# EAGLE design etchasketch (EAGLE 9.6.2)
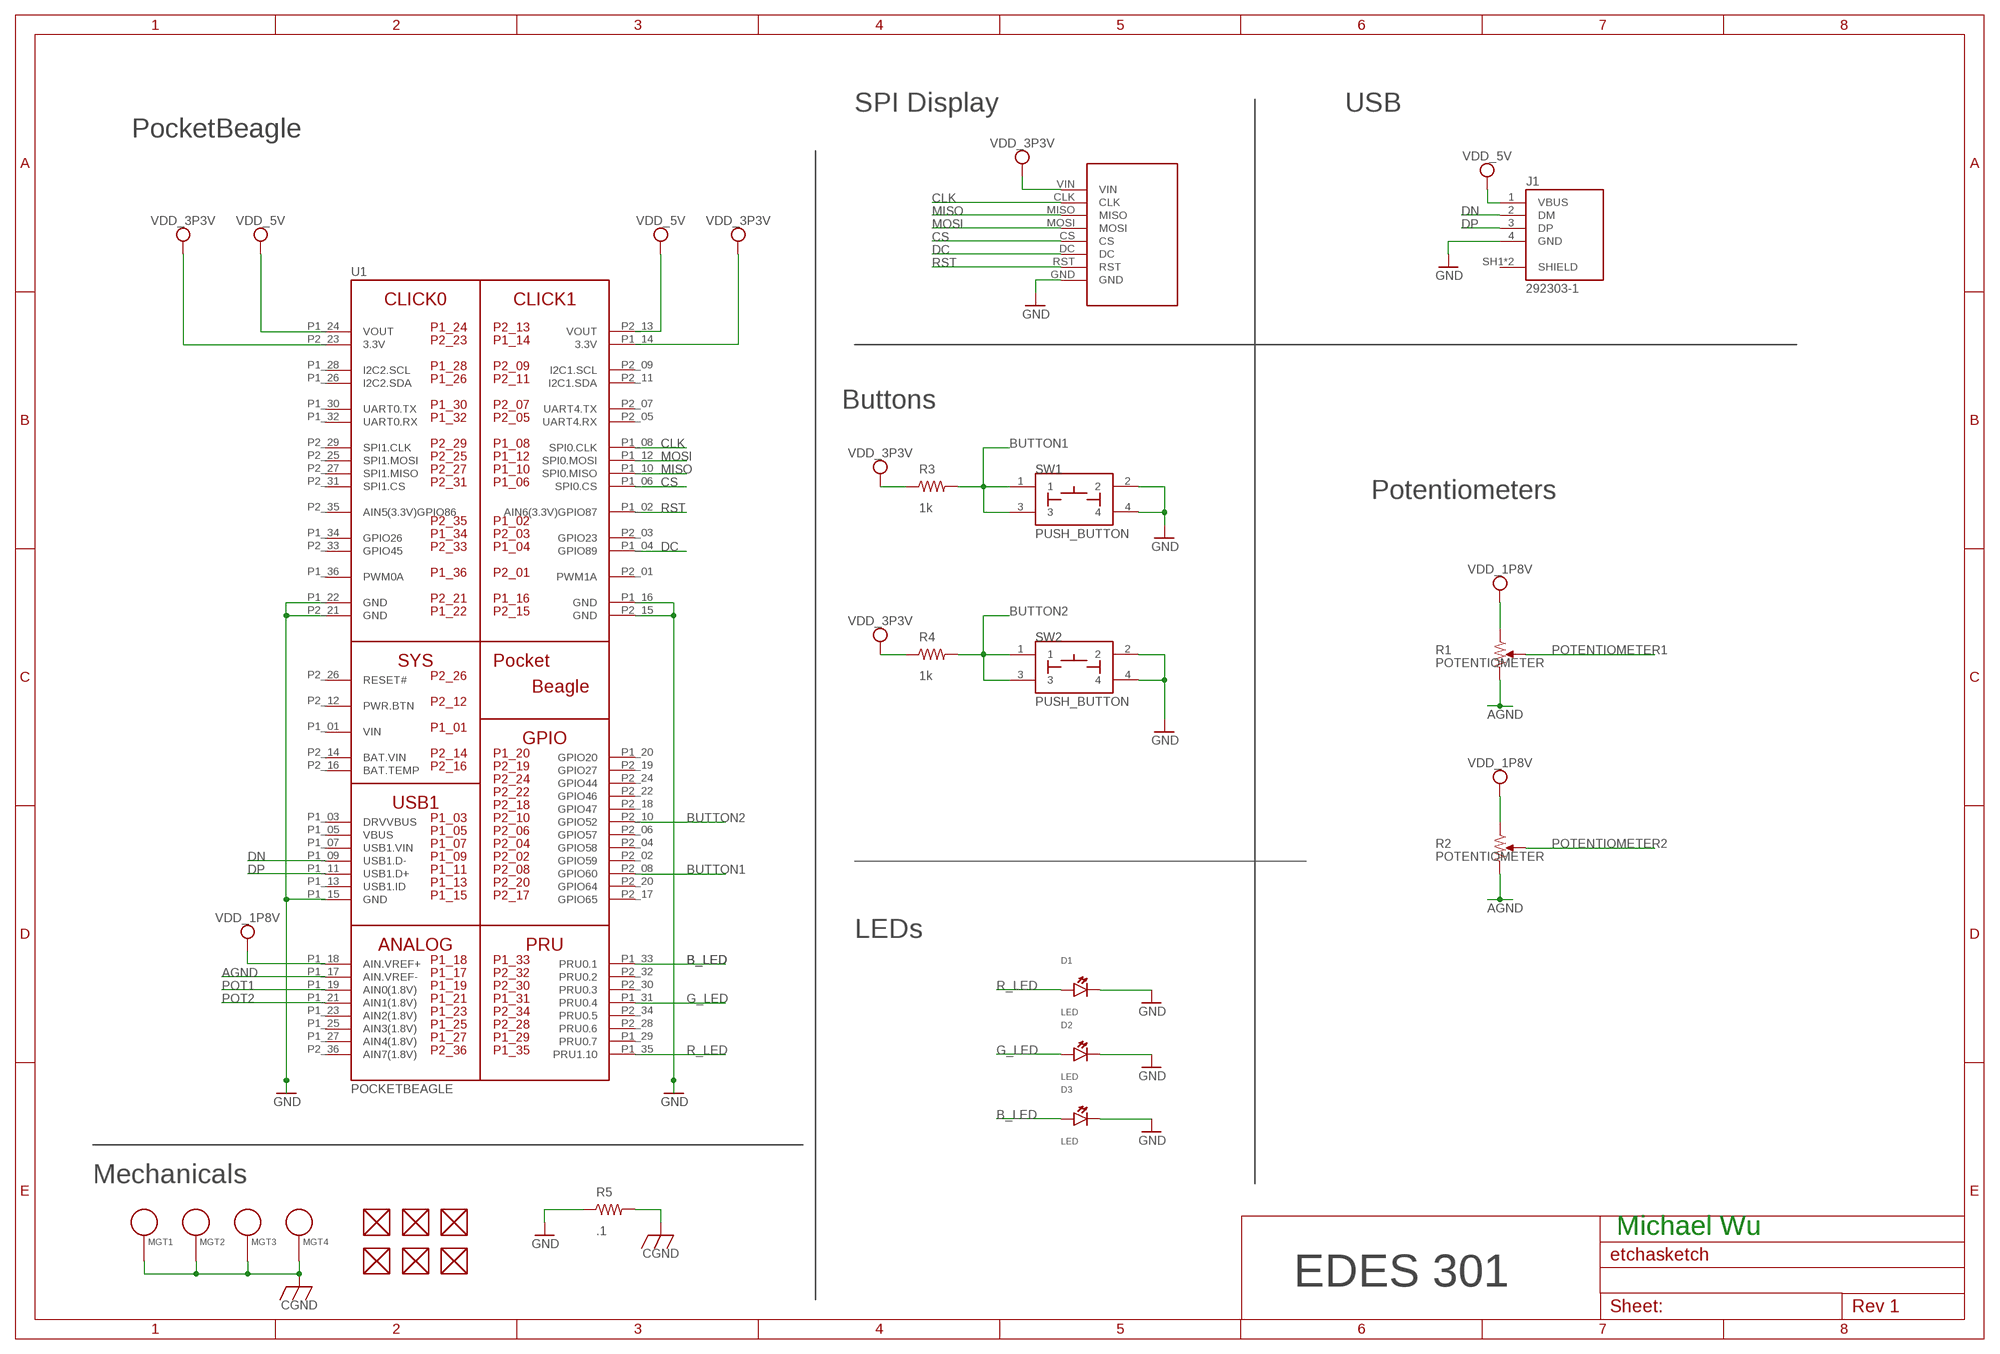
[diagram p0: schematic, sheet 1]

## Parts
D1  LED  [EIA-STD]
D2  LED  [EIA-STD]
D3  LED  [EIA-STD]
FUD1  FIDUCIAL  [FIDUCIAL_40MIL]
FUD2  FIDUCIAL  [FIDUCIAL_40MIL]
FUD3  FIDUCIAL  [FIDUCIAL_40MIL]
FUD4  FIDUCIAL  [FIDUCIAL_40MIL]
FUD5  FIDUCIAL  [FIDUCIAL_40MIL]
FUD6  FIDUCIAL  [FIDUCIAL_40MIL]
J1  292303-1  [TE_292303-1]
MGT1  MOUNTING_HOLE  [MOUNTING_HOLE]
MGT2  MOUNTING_HOLE  [MOUNTING_HOLE]
MGT3  MOUNTING_HOLE  [MOUNTING_HOLE]
MGT4  MOUNTING_HOLE  [MOUNTING_HOLE]
R1  POTENTIOMETER  [POT-PO90S]
R2  POTENTIOMETER  [POT-PO90S]
R3  1k  R_R0603  [R0603]
R4  1k  R_R0603  [R0603]
R5  .1  R_R1206  [R1206]
SW1  PUSH_BUTTON  [BUTTON_12.5MM]
SW2  PUSH_BUTTON  [BUTTON_12.5MM]
U1  POCKETBEAGLE  [POCKETBEAGLE]
U$1  SCREEN  [SCREEN]

## Nets
AGND: R1.CW R2.CW U1.P1_17(AIN.VREF-)
B_LED: D3.ANODE U1.P1_33(PRU0.1)
BUTTON1: R3.2 SW1.1 SW1.3 U1.P2_08(GPIO60)
BUTTON2: R4.2 SW2.1 SW2.3 U1.P2_10(GPIO52)
CGND: MGT1.P$1 MGT2.P$1 MGT3.P$1 MGT4.P$1 R5.2
CLK: U1.P1_08(SPI0.CLK) U$1.CLK
CS: U1.P1_06(SPI0.CS) U$1.CS
DC: U1.P1_04(GPIO89) U$1.DC
DN: J1.2(DM) U1.P1_09(USB1.D-)
DP: J1.3(DP) U1.P1_11(USB1.D+)
G_LED: D2.ANODE U1.P1_31(PRU0.4)
GND [pwr/gnd]: D1.CATHODE D2.CATHODE D3.CATHODE J1.4(GND) R5.1 SW1.2 SW1.4 SW2.2 SW2.4 U1.P1_15(GND) U1.P1_16(GND) U1.P1_22(GND) U1.P2_15(GND) U1.P2_21(GND) U$1.GND
MISO: U1.P1_10(SPI0.MISO) U$1.MISO
MOSI: U1.P1_12(SPI0.MOSI) U$1.MOSI
POT1: U1.P1_19(AIN0(1.8V))
POT2: U1.P1_21(AIN1(1.8V))
POTENTIOMETER1: R1.S
POTENTIOMETER2: R2.S
R_LED: D1.ANODE U1.P1_35(PRU1.10)
RST: U1.P1_02(AIN6(3.3V)GPIO87) U$1.RST
VDD_1P8V: R1.CCW R2.CCW U1.P1_18(AIN.VREF+)
VDD_3P3V: R3.1 R4.1 U1.P1_14(3.3V) U1.P2_23(3.3V) U$1.VIN
VDD_5V: J1.1(VBUS) U1.P1_24(VOUT) U1.P2_13(VOUT)
Unconnected: FUD1.P$1 FUD2.P$1 FUD3.P$1 FUD4.P$1 FUD5.P$1 FUD6.P$1 J1.SH1(SHIELD) J1.SH2(SHIELD) U1.P1_03(DRVVBUS) U1.P1_05(VBUS) U1.P1_07(USB1.VIN) U1.P1_13(USB1.ID) U1.P1_20(GPIO20) U1.P1_23(AIN2(1.8V)) U1.P1_25(AIN3(1.8V)) U1.P1_26(I2C2.SDA) U1.P1_27(AIN4(1.8V)) U1.P1_28(I2C2.SCL) U1.P1_29(PRU0.7) U1.P1_30(UART0.TX) U1.P1_32(UART0.RX) U1.P1_34(GPIO26) U1.P1_36(PWM0A) U1.P2_01(PWM1A) U1.P2_02(GPIO59) U1.P2_03(GPIO23) U1.P2_04(GPIO58) U1.P2_05(UART4.RX) U1.P2_06(GPIO57) U1.P2_07(UART4.TX) U1.P2_09(I2C1.SCL) U1.P2_11(I2C1.SDA) U1.P2_12(PWR.BTN) U1.P2_16(BAT.TEMP) U1.P2_17(GPIO65) U1.P2_18(GPIO47) U1.P2_19(GPIO27) U1.P2_20(GPIO64) U1.P2_22(GPIO46) U1.P2_24(GPIO44) U1.P2_25(SPI1.MOSI) U1.P2_26(RESET#) U1.P2_27(SPI1.MISO) U1.P2_28(PRU0.6) U1.P2_29(SPI1.CLK) U1.P2_30(PRU0.3) U1.P2_31(SPI1.CS) U1.P2_32(PRU0.2) U1.P2_33(GPIO45) U1.P2_34(PRU0.5) U1.P2_35(AIN5(3.3V)GPIO86) U1.P2_36(AIN7(1.8V))

## Notes on the sheet
- SPI Display | USB
- PocketBeagle
- Buttons
- Potentiometers
- LEDs
- Mechanicals
- Michael Wu
- EDES 301

## Power pins joined to a net without a drawn wire
BAT.VIN: U1.P2_14(BAT.VIN)
VIN: U1.P1_01(VIN)

## Library data of the parts
D1-D3 = etchasketch:LED: EIA-STD LED, LTST-C191TBKT
FUD1-FUD6 = etchasketch:FIDUCIAL
J1 = etchasketch:292303-1: CONN USB RECEPT R/A TYPE A 4POS Check availability <https://pricing.snapeda.com/parts/292303-1/TE%20Connectivity/view-part?ref=eda>; AVAILABILITY: In Stock; CENTERLINE_PITCH: 2 mm[.078 in]; COMMENT: 292303-1; DESCRIPTION: Conn; Data; USB; Recept; 2.0; 4 Pos; 1 Port; Rt Angle; A Ser; Tin over Copper; EU_ROHS_COMPLIANCE: Compliant; MF: TE Connectivity; MP: 292303-1; NUMBER_OF_POSITIONS: 4; PACKAGE: None; PRICE: None; PRODUCT_TYPE: Connector; PURCHASE-URL: https://pricing.snapeda.com/search/part/292303-1/?ref=eda
MGT1-MGT4 = etchasketch:MOUNTING_HOLE: Chassis Mounting Hole w/GND connection ability
R1 R2 = etchasketch:POTENTIOMETER: Potentiometer - Examples: P090S-14T20BR10K (987-1277-ND)
R3 R4 = MISC:R_: RESISTOR, American symbol
R5 = etchasketch:R_: RESISTOR, American symbol
SW1 SW2 = etchasketch:PUSH_BUTTON
U1 = etchasketch:POCKETBEAGLE
U$1 = etchasketch:SCREEN

## Net classes
1 pwr/gnd: width 0.381 mm, drill 0.305 mm, clearance 0.381 mm

## Board
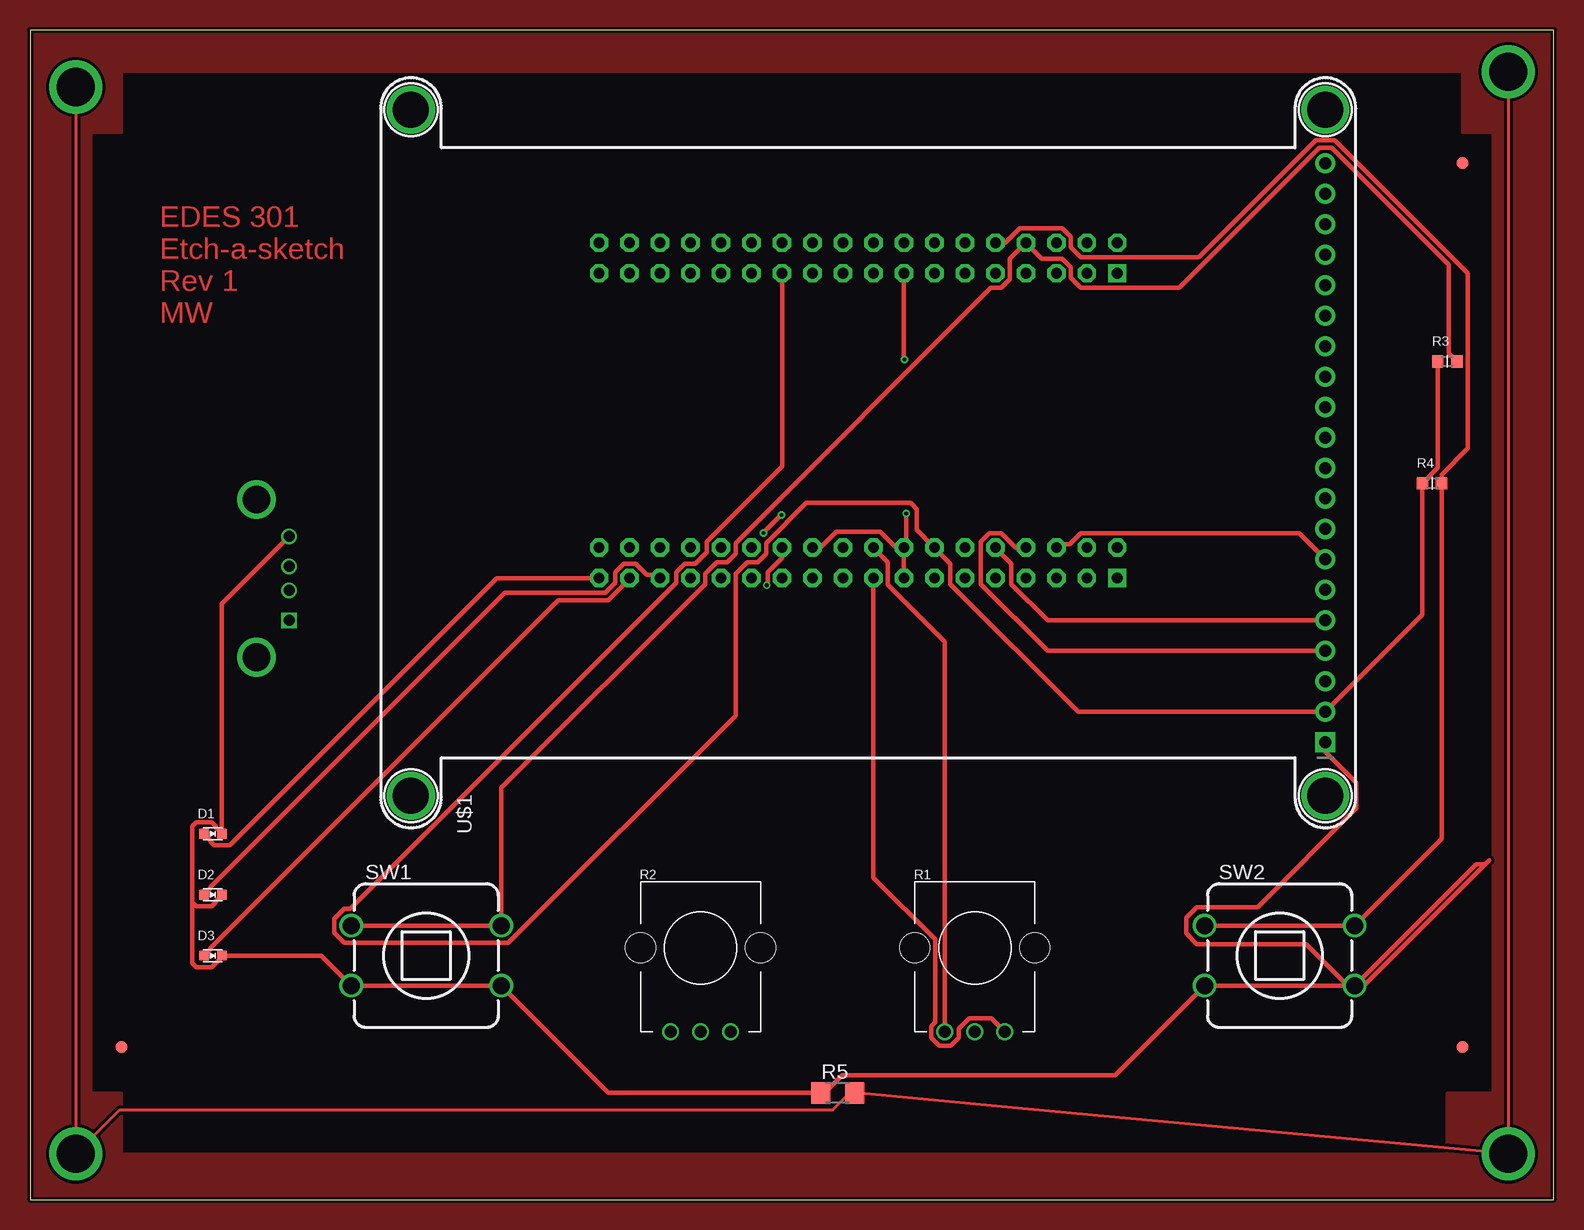
[diagram p1: board, top side]
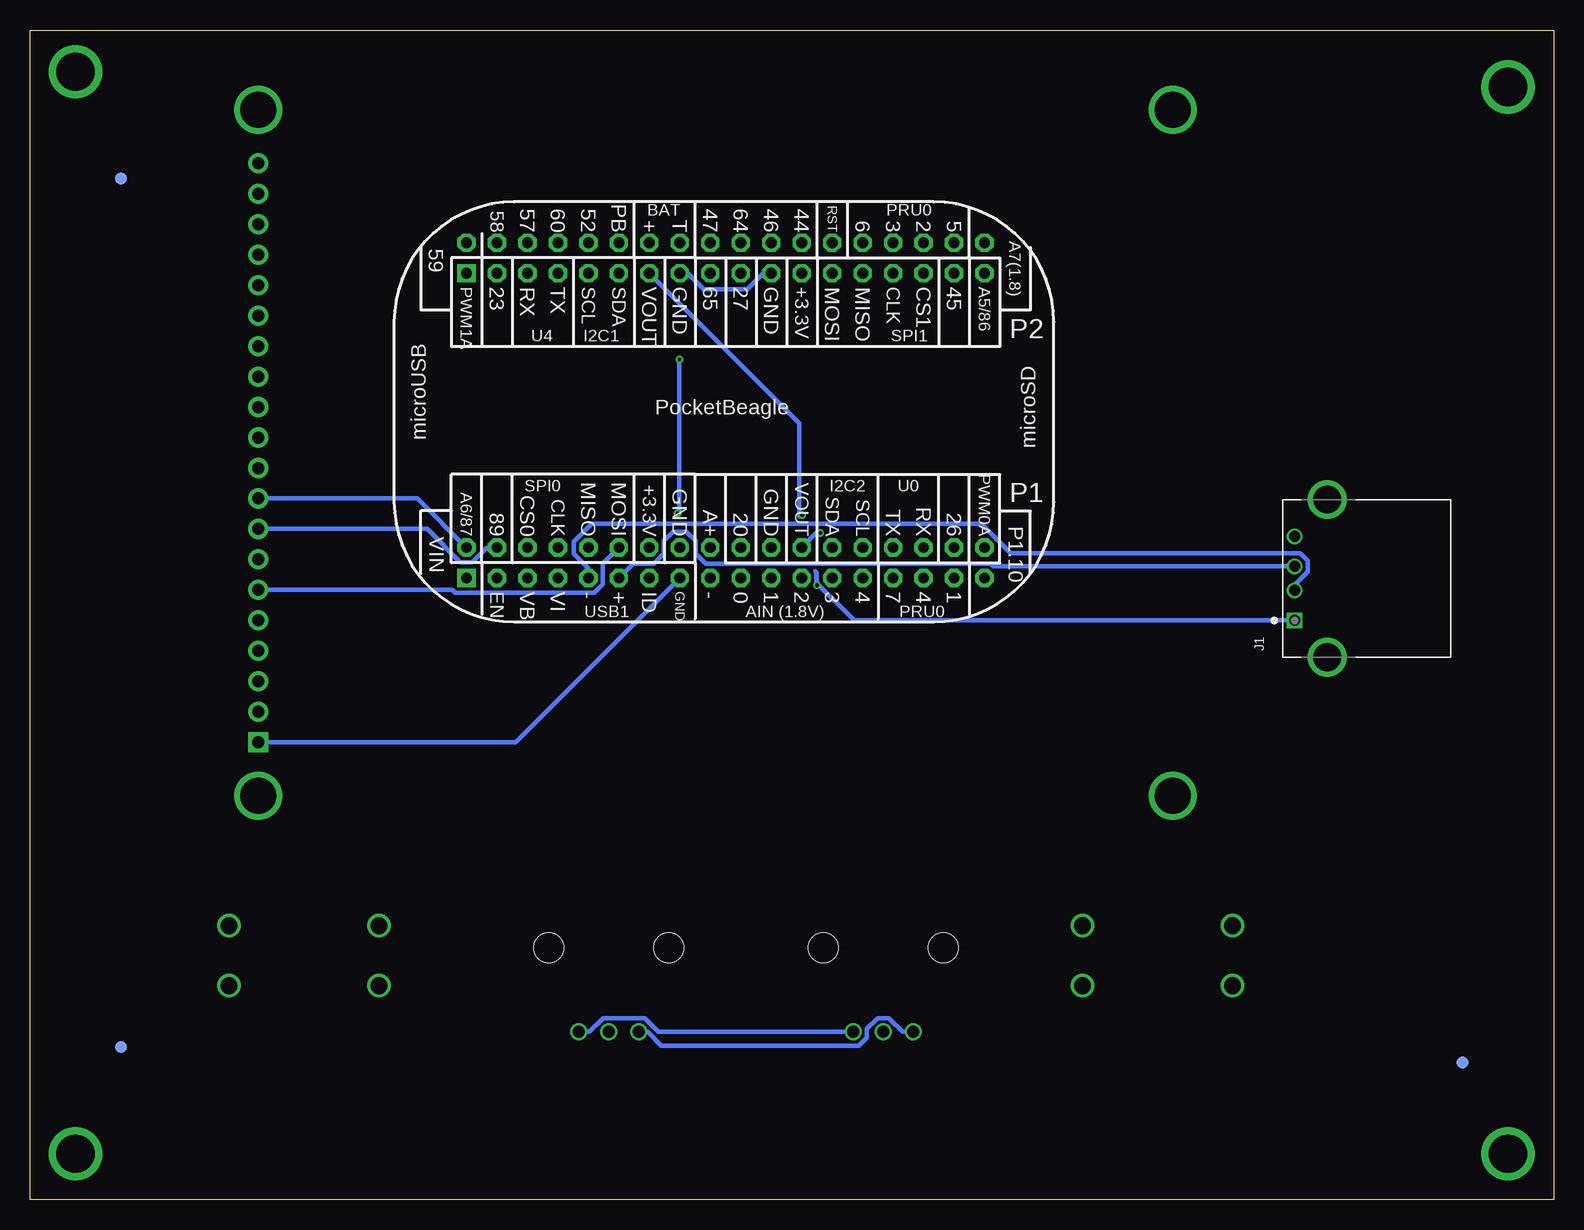
[diagram p2: board, bottom side, seen from below]

Size 126.98 x 97.46 mm. Coordinates in mm from the lower left corner, seen from the top.
Outline: 0,0 126.98,0 126.98,97.46 0,97.46 0,0
Copper layers (1*16): Top 0.035mm / dielectric 1.53mm / Bottom 0.035mm
Design rules "EDES301_2lyr": minimum track width 10mil, minimum drill 12mil, track to track 10mil, track to pad 10mil, pad to pad 10mil, via to via 10mil, smd to smd 10mil, copper to edge 10mil, drill to drill 12mil, minimum pad ring 6mil, minimum via ring 6mil, stop-mask expansion 3mil, vias tented up to drill 25mil, thermal gap 10mil

### Footprints (pad centres in the part's own frame; a part is rotated, then mirrored left to right if it is on the bottom)
EIA-STD = smd 0.8 x 0.8: ANODE -0.75,0; CATHODE 0.75,0
FIDUCIAL_40MIL = smd 1.016 x 1.016: P$1 0,0
TE_292303-1 = drill 0.92 square: 1 0,0 | drill 0.92: 2 2.5,0; 3 4.5,0; 4 7,0 | drill 2.3: SH1 -3.07,-2.71; SH2 10.07,-2.71
MOUNTING_HOLE = drill 3.175 pad 4.445: P$1 0,0
POT-PO90S = drill 1: CCW -2.5,0; CW 2.5,0; S 0,0 | hole 2.5: -5,7; 5,7
R0603 = smd 0.95 x 1.031: 1 -0.8,0; 2 0.8,0
R1206 = smd 1.6 x 1.803: 1 -1.422,0; 2 1.422,0
BUTTON_12.5MM = drill 1.4: 1 -6.25,2.5; 2 -6.25,-2.5; 3 6.25,2.5; 4 6.25,-2.5
POCKETBEAGLE = drill 0.889 pad 1.524 square: P1_01 5.91,3.53; P2_01 5.91,28.93 | drill 0.889 pad 1.524 octagon: P1_02 5.91,6.07; P1_03 8.45,3.53; P1_04 8.45,6.07; P1_05 10.99,3.53; P1_06 10.99,6.07; P1_07 13.53,3.53; P1_08 13.53,6.07; P1_09 16.07,3.53; P1_10 16.07,6.07; P1_11 18.61,3.53; P1_12 18.61,6.07; P1_13 21.15,3.53; P1_14 21.15,6.07; P1_15 23.69,3.53; P1_16 23.69,6.07; P1_17 26.23,3.53; P1_18 26.23,6.07; P1_19 28.77,3.53; P1_20 28.77,6.07; P1_21 31.31,3.53; P1_22 31.31,6.07; P1_23 33.85,3.53; P1_24 33.85,6.07; P1_25 36.39,3.53; P1_26 36.39,6.07; P1_27 38.93,3.53; P1_28 38.93,6.07; P1_29 41.47,3.53; P1_30 41.47,6.07; P1_31 44.01,3.53; P1_32 44.01,6.07; P1_33 46.55,3.53; P1_34 46.55,6.07; P1_35 49.09,3.53; P1_36 49.09,6.07; P2_02 5.91,31.47; P2_03 8.45,28.93; P2_04 8.45,31.47; P2_05 10.99,28.93; P2_06 10.99,31.47; P2_07 13.53,28.93; P2_08 13.53,31.47; P2_09 16.07,28.93; P2_10 16.07,31.47; P2_11 18.61,28.93; P2_12 18.61,31.47; P2_13 21.15,28.93; P2_14 21.15,31.47; P2_15 23.69,28.93; P2_16 23.69,31.47; P2_17 26.23,28.93; P2_18 26.23,31.47; P2_19 28.77,28.93; P2_20 28.77,31.47; P2_21 31.31,28.93; P2_22 31.31,31.47; P2_23 33.85,28.93; P2_24 33.85,31.47; P2_25 36.39,28.93; P2_26 36.39,31.47; P2_27 38.93,28.93; P2_28 38.93,31.47; P2_29 41.47,28.93; P2_30 41.47,31.47; P2_31 44.01,28.93; P2_32 44.01,31.47; P2_33 46.55,28.93; P2_34 46.55,31.47; P2_35 49.09,28.93; P2_36 49.09,31.47
SCREEN = drill 1 pad 1.676: 3VO -19.05,-38.1; 12@JP2 3.81,-38.1; 13@JP2 6.35,-38.1; 14@JP2 8.89,-38.1; 15@JP2 11.43,-38.1; 16@JP2 13.97,-38.1; 17@JP2 16.51,-38.1; 18@JP2 19.05,-38.1; 19@JP2 21.59,-38.1; 20@JP2 24.13,-38.1; CLK -16.51,-38.1; CS -8.89,-38.1; DC -6.35,-38.1; GND@1 1.27,-38.1; LITE -1.27,-38.1; MISO -13.97,-38.1; MOSI -11.43,-38.1; RST -3.81,-38.1; VIN -21.59,-38.1 | drill 1 pad 1.676 square: GND -24.13,-38.1 | drill 3 pad 3.6: P$1@U$7 -28.575,-38.1; P$1@U$15 28.575,-38.1; P$1@U$16 -28.575,38.1; P$1@U$17 28.575,38.1

### Placement (x,y rotation side)
D1  15.24,30.48 0 top
D2  15.24,25.4 0 top
D3  15.24,20.32 0 top
FUD1  7.62,12.7 0 top
FUD2  119.38,12.7 0 top
FUD3  119.38,12.7 0 bottom
FUD4  119.38,86.36 0 top
FUD5  119.38,85.09 0 bottom
FUD6  7.62,11.43 0 bottom
J1  21.59,48.26 90 bottom
MGT1  3.81,92.71 0 top
MGT2  3.81,3.81 0 top
MGT3  123.19,93.98 0 top
MGT4  123.19,3.81 0 top
R1  78.74,13.97 0 top
R2  55.88,13.97 0 top
R3  118.11,69.85 0 top
R4  116.84,59.69 0 top
R5  67.31,8.89 0 top
SW1  33.02,20.32 0 top
SW2  104.14,20.32 0 top
U1  96.52,48.26 0 bottom
U$1  69.85,62.23 90 top

### Tracks (layer width: path | path; a pad name or v marks a point on that pad's centre or on a via)
AGND
  Top 0.381: U1.P1_17 70.29,26.82 75.43,21.67 75.43,14.78 75.1,14.44 75.1,13.5 75.77,12.82 76.71,12.82 77.39,13.5 77.39,14.23 78.27,15.11 80.1,15.11 R1.CW
  Bottom 0.381: R2.CW 74.62,13.97 75.77,15.11 79.21,15.11 80.36,13.97 R1.CW
B_LED
  Top 0.381: D3.ANODE 15.02,20.85 15.02,20.96 44.01,49.95 48.19,49.95 49.4,51.15 49.4,51.22 U1.P1_33
BUTTON1
  Top 0.381: SW1.1 SW1.3 39.27,34.3 56.26,51.29 56.26,52.16 57.22,53.12 58.09,53.12 58.8,53.83 58.8,54.7 80.08,75.98 80.95,75.98 81.66,76.69 81.66,78.4 U1.P2_08 84.32,78.4 86.03,78.4 86.74,77.69 86.74,76.82 87.57,75.98 95.76,75.98 107.42,87.64 108.48,87.64 118.23,77.89 118.23,70.53 R3.2
BUTTON2
  Top 0.381: SW2.1 SW2.3 117.64,30.07 R4.2 117.64,60.41 119.83,62.6 119.83,77.19 108.74,88.28 107.16,88.28 97.4,78.52 87.57,78.52 86.74,79.36 86.74,80.23 86.03,80.94 82.49,80.94 81.28,79.73 U1.P2_10
CGND
  Top 0.254: MGT1.P$1 MGT2.P$1 7.48,7.48 66.9,7.48 68.31,8.89 R5.2 83.18,7.54 MGT4.P$1 MGT3.P$1
CGND1
  pour Top: -2.54,48.26 -2.54,101.6 129.54,101.6 129.54,45.72 121.92,45.72 121.92,88.9 119.38,88.9 119.38,93.98 7.62,93.98 7.62,88.9 5.08,88.9 5.08,48.26
CGND2
  pour Top: -2.54,49.53 5.08,49.53 5.08,8.89 7.62,8.89 7.62,3.81 118.11,3.81 118.11,8.89 121.92,8.89 121.92,46.99 129.54,46.99 129.54,-3.81 -2.54,-3.81
CLK
  Top 0.381: U$1.CLK 84.81,45.72 79.24,51.29 79.24,54.83 79.95,55.54 80.95,55.54 82.16,54.33 U1.P1_08
CS  (via drill 0.3 pad 0.61)
  Top 0.381: 85.81,54.61 85.72,54.61 | U$1.CS 105.75,55.54 87.57,55.54 86.64,54.61 86.36,54.61 85.81,54.61 | U1.P1_06 85.81,54.61
  other vias: 107.95,53.34 107.95,53.34
DC
  Bottom 0.381: U$1.DC 93.87,55.88 91.11,53.12 90.11,53.12 88.9,54.33 U1.P1_04
DN
  Bottom 0.381: U1.P1_09 80.45,52.62 81.66,53.83 81.66,54.83 80.19,56.3 47.69,56.3 45.24,53.85 21.14,53.85 20.5,53.21 20.5,52.31 21.59,51.22 J1.2
DP
  Bottom 0.381: J1.3 46.69,52.76 46.93,53 70.66,53 71.5,53.83 71.5,54.88 72.28,55.66 73.38,55.66 74.16,54.88 74.16,53.83 75,53 76.7,53 U1.P1_11
G_LED
  Top 0.381: D2.ANODE 15.02,25.93 15.02,26.04 39.56,50.58 47.93,50.58 48.76,51.42 48.76,52.29 49.47,53 50.47,53 51.4,52.07 52.23,52.07 U1.P1_31
GND  (via drill 0.3 pad 0.61)
  Top 0.381: J1.4 15.99,49.66 D1.CATHODE 15.46,31.01 15.46,31.12 15.13,31.45 13.85,31.45 13.52,31.12 13.52,24.76 | D3.CATHODE 16.1,20.32 | 16.1,20.32 24.27,20.32 SW1.2 SW1.4 48.2,8.89 R5.1 66.22,8.89 67.69,10.36 90.43,10.36 SW2.2 SW2.4 120.51,27.94 121.28,27.94 | 13.52,24.76 13.52,19.68 13.85,19.35 15.13,19.35 16.1,20.32 | U$1.GND 107.95,37.3 110.53,34.72 110.53,32.59 102.31,24.37 97.25,24.37 96.34,23.46 96.34,22.18 97.25,21.27 106.37,21.27 110.49,17.14 121.28,27.94 | 121.28,27.94 121.6,28.26 | U1.P2_15 72.83,70.05 v72.86,70.01 72.95,69.93 | v73.03,57.17 73.03,54.52 U1.P1_16 | U1.P1_16 U1.P1_15 | U1.P1_16 72.18,54.33 70.84,55.66 67.2,55.66 65.86,54.33 U1.P1_22 | 13.52,24.76 13.85,24.43 15.13,24.43 15.46,24.76 15.46,24.87 D2.CATHODE
  Bottom 0.381: U$1.GND 86.52,38.1 U1.P1_15 | v72.86,70.01 72.86,57.22 73.03,57.06 v73.03,57.17 | U1.P2_15 72.18,77.19 70.84,75.86 67.2,75.86 65.86,77.19 U1.P2_21
MISO
  Top 0.381: U1.P1_10 81.78,53 81.78,51.29 84.81,48.26 U$1.MISO
MOSI
  Bottom 0.381: U$1.MOSI 91.77,50.8 91.56,50.58 79.95,50.58 79.24,51.29 79.24,53 U1.P1_12
R_LED
  Top 0.381: D1.ANODE 15.02,29.95 15.02,29.84 15.35,29.51 16.63,29.51 38.91,51.79 U1.P1_35
RST
  Bottom 0.381: U$1.RST 94.7,58.42 U1.P1_02
VDD_1P8V
  Top 0.381: U1.P1_18 71.5,53.12 71.5,51.24 76.24,46.49 R1.CCW
  Bottom 0.381: R1.CCW 75.52,13.97 74.38,12.82 57.91,12.82 57.24,13.5 57.24,14.23 56.35,15.11 55.41,15.11 54.26,13.97 R2.CCW
VDD_3P3V
  Top 0.381: R3.1 117.31,60.98 116.72,60.39 116.72,60.37 R4.1 116.04,48.73 U$1.VIN 87.35,40.64 76.7,51.29 76.7,53 U1.P1_14 73.9,55.8 73.9,57.54 73.39,58.05 64.69,58.05 61.34,54.7 61.34,53.83 60.63,53.12 59.76,53.12 58.8,52.16 58.8,40.33 39.86,21.39 26.18,21.39 25.35,22.23 25.35,23.41 26.18,24.24 26.67,24.24 53.84,51.42 53.84,52.29 54.55,53 55.42,53 56.38,53.96 56.38,54.83 62.67,61.12 U1.P2_23
VDD_5V  (via drill 0.3 pad 0.61)
  Top 0.381: v61.4,51.19 61.46,51.26 61.46,52.29 62.67,53.5 U1.P1_24 | v62.62,57.05 v61.12,55.55
  Bottom 0.381: 61.53,52.36 61.46,52.29 | J1.1 58.31,48.26 61.46,51.42 61.46,52.29 | 61.46,52.29 61.4,52.23 v61.4,51.19 | U1.P2_13 62.87,64.69 62.87,56.93 62.74,56.93 v62.62,57.05 | v61.12,55.55 61.45,55.55 U1.P1_24
  other vias: 75.37,77.19

### Text on the board
Top: EDES 301 / Etch-a-sketch / Rev 1 / MW